# EAGLE schematic flashlight (EAGLE 7.2.0)
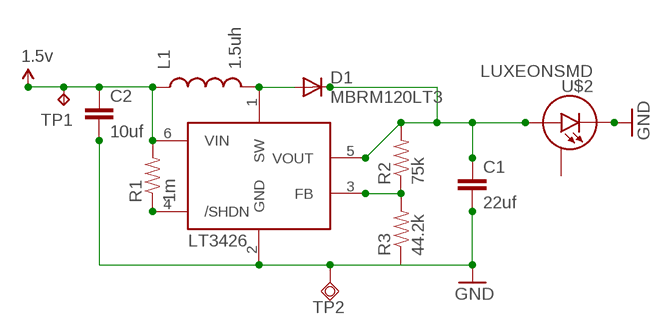
[diagram p0: schematic, sheet 1]

## Parts
C1  22uf  CAP0805  [0805]
C2  10uf  CAP0805  [0805]
D1  MBRM120LT3  PMLL4150  [SOD80C]
L1  1.5uh  INDUCTOR1007  [1007]
R1  1m  RESISTOR0805-RES  [0805]
R2  75k  RESISTOR0805-RES  [0805]
R3  44.2k  RESISTOR0805-RES  [0805]
TP1  TPTP20R  [TP20R]
TP2  TPSQPAD1-13  [P1-13]
U$1  LT3426  [SOT23-6]
U$2  LUXEONSMD  [LUXEON]

## Nets
GND: C1.2 C2.2 R3.1 TP2.TP U$1.2(GND) U$2.C
N$1: D1.A L1.2 U$1.1(SW)
N$3: R1.1 U$1.4(/SHDN)
N$4: R2.1 R3.2 U$1.3(FB)
N$6: C1.1 D1.C R2.2 U$1.5(VOUT) U$2.A
VCC: C2.1 L1.1 R1.2 TP1.TP U$1.6(VIN) ; supply symbol labelled 1.5v
Unconnected: U$2.S

## Library data of the parts
C1 C2 = SparkFun-Passives:CAP: Capacitor Standard 0603 ceramic capacitor, and 0.1" leaded capacitor.
D1 = diode:PMLL4150: DIODE high speed
L1 = SparkFun-Passives:INDUCTOR: Inductors Basic Inductor/Choke - 0603 and 1206. Footprints are not proven and vary greatly between part numbers. SRN6045- 33uH, 20% 1.4A SDR0403-560KL - 56uH, 10%, 500mA RMS/740mA peak
R1-R3 = SparkFun-Passives:RESISTOR: Resistor Basic schematic elements and footprints for 0603, 1206, and PTH resistors.
TP1 = testpad:TP: Test pad
TP2 = testpad:TPSQ: Test pad
U$1 = adafruit:LT3426: LT3426 1.2MHz, 2A boost converter in SOT-23 http://www.linear.com/pc/productDetail.jsp?navId=H0,C1,C1003,C1042,C1031,C1061,P8430 (Linear website)
U$2 = SparkFun-LED:LUXEON: Luxeon LED This footprint works with the current 1 Watt, 3 Watt, and 5 Watt LEDs. These blindingly bright LEDs generate a lot of heat so the footprint has a large pad under the LED for thermal transfer. Schematic and footprint are proven. Spark Fun Electronics SKU : COM-00603